# Altium schematic sheet Microprocessor Module (328).SchDoc
size A4; SheetNumber: 1; SheetTotal: 1
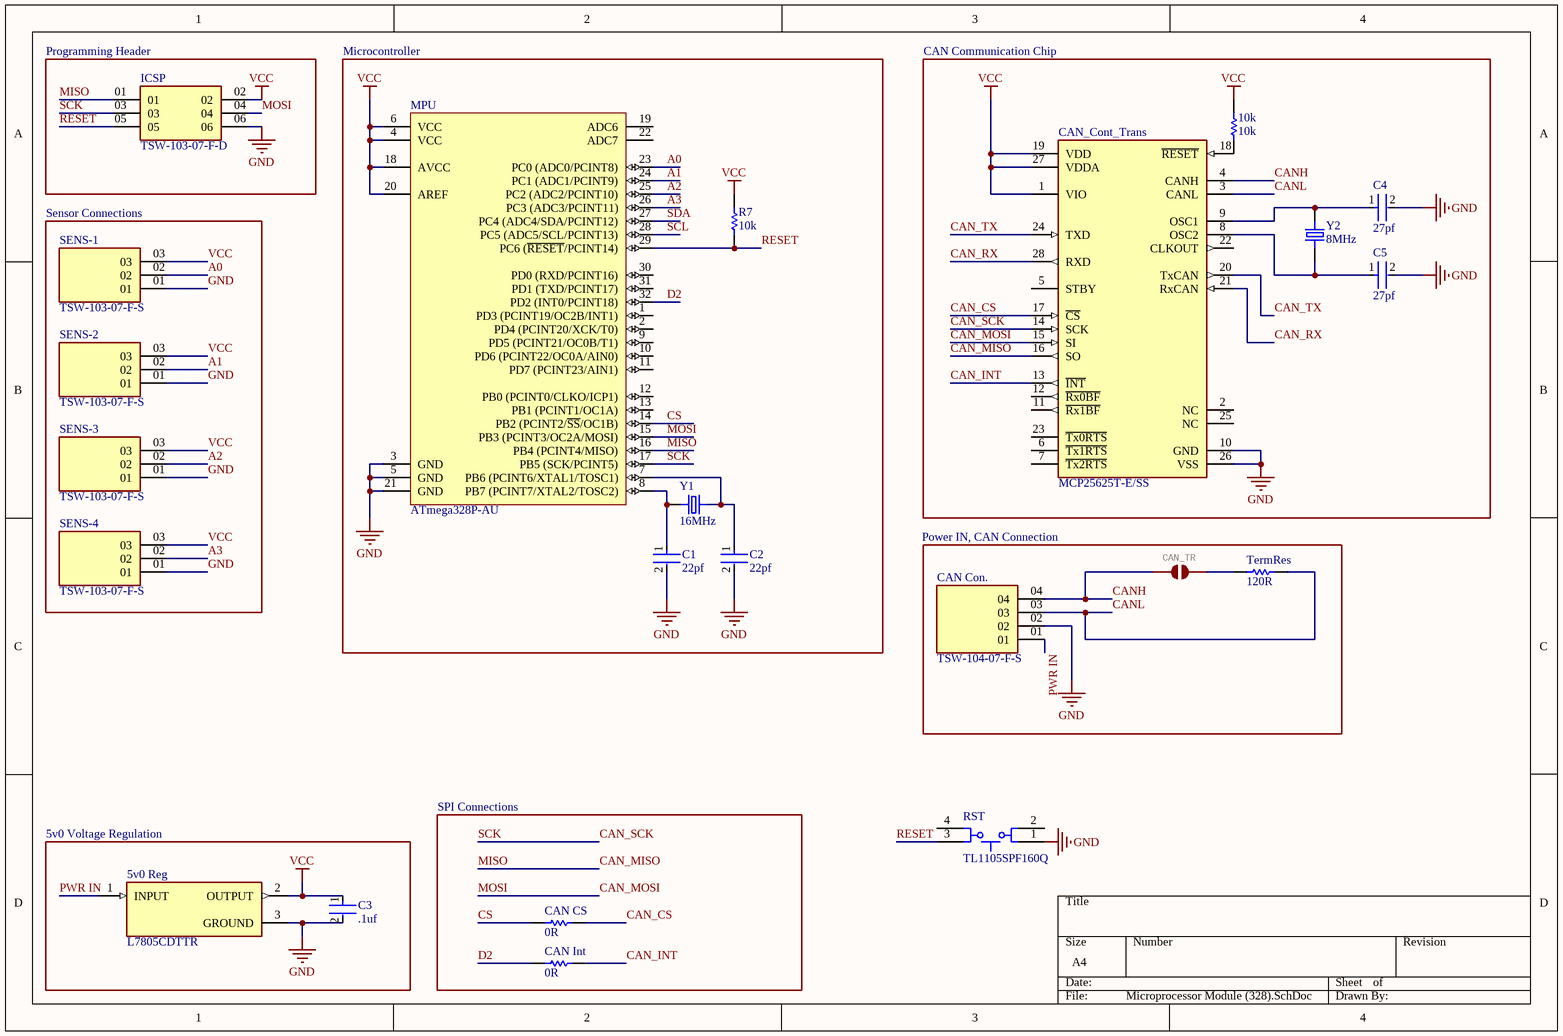
[diagram p0: Microprocessor Module (328).SchDoc]

## Parts
5v0_Reg  L7805CDTTR  [VREG_L7805CDTTR]
10k  10k  [RESC2013X60X40LL20T25]
C1  22pf  [FP-GRM21B-0_15-IPC_C]
C2  22pf  [FP-GRM21B-0_15-IPC_C]
C3  .1uf  [FP-GRM21B-0_15-IPC_C]
C4  27pf  [FP-GRM21B-0_15-IPC_C]
C5  27pf  [FP-GRM21B-0_15-IPC_C]
CAN_Con.  TSW-104-07-F-S  [SAMTEC_TSW-104-07-F-S]
CAN_Cont_Trans  MCP25625T-E/SS  [FP-C04-073-IPC_B]
CAN_CS  0R  [RESC2013X60X40LL20T25]
CAN_Int  0R  [RESC2013X60X40LL20T25]
CAN_TR  (no value)  [SMT-JUMPER_2_NO_SILK]
ICSP  TSW-103-07-F-D  [SAMTEC_TSW-103-07-F-D]
MPU  ATmega328P-AU  [32A_M]
R7  10k  [RESC2013X60X40LL20T25]
RST  TL1105SPF160Q  [ESWI-TL1105SPF_V]
SENS-1  TSW-103-07-F-S  [SAMTEC_TSW-103-07-F-S]
SENS-2  TSW-103-07-F-S  [SAMTEC_TSW-103-07-F-S]
SENS-3  TSW-103-07-F-S  [SAMTEC_TSW-103-07-F-S]
SENS-4  TSW-103-07-F-S  [SAMTEC_TSW-103-07-F-S]
TermRes  120R  [RESC2013X60X40LL20T25]
Y1  16MHz  [XTAL_ECS-080-20-5PX-TR]
Y2  8MHz  [XTAL_ECS-080-20-5PX-TR]

## Blocks framed on the sheet
Programming Header: ICSP
Microcontroller: C1 C2 MPU R7 Y1
CAN Communication Chip: 10k C4 C5 CAN_Cont_Trans Y2
Sensor Connections: SENS-1-SENS-4
Power IN, CAN Connection: CAN_Con. CAN_TR TermRes
5v0 Voltage Regulation: 5v0_Reg C3
SPI Connections: CAN_CS CAN_Int

## Nets
GND: 5v0_Reg.3(GROUND) C1.2 C2.2 C3.2 C4.2 C5.2 CAN_Con..02 CAN_Cont_Trans.10(GND) CAN_Cont_Trans.26(VSS) ICSP.06 MPU.3(GND) MPU.5(GND) MPU.21(GND) RST.1 SENS-1.01 SENS-2.01 SENS-3.01 SENS-4.01
VCC: 5v0_Reg.2(OUTPUT) 10k.2 C3.1 CAN_Cont_Trans.1(VIO) CAN_Cont_Trans.19(VDD) CAN_Cont_Trans.27(VDDA) ICSP.02 MPU.4(VCC) MPU.6(VCC) MPU.18(AVCC) MPU.20(AREF) R7.2 SENS-1.03 SENS-2.03 SENS-3.03 SENS-4.03
A0: MPU.23(PC0_(ADC0/PCINT8)) SENS-1.02
A1: MPU.24(PC1_(ADC1/PCINT9)) SENS-2.02
A2: MPU.25(PC2_(ADC2/PCINT10)) SENS-3.02
A3: MPU.26(PC3_(ADC3/PCINT11)) SENS-4.02
CAN_CS: CAN_Cont_Trans.17(~{CS}) CAN_CS.2
CAN_INT: CAN_Cont_Trans.13(~{INT}) CAN_Int.2
CAN_MISO: CAN_Cont_Trans.16(SO) ICSP.01 MPU.16(PB4_(PCINT4/MISO))  [also labelled MISO]
CAN_MOSI: CAN_Cont_Trans.15(SI) ICSP.04 MPU.15(PB3_(PCINT3/OC2A/MOSI))  [also labelled MOSI]
CAN_RX: CAN_Cont_Trans.21(RxCAN) CAN_Cont_Trans.28(RXD)
CAN_SCK: CAN_Cont_Trans.14(SCK) ICSP.03 MPU.17(PB5_(SCK/PCINT5))  [also labelled SCK]
CAN_TX: CAN_Cont_Trans.20(TxCAN) CAN_Cont_Trans.24(TXD)
CANH: CAN_Con..04 CAN_Cont_Trans.4(CANH) CAN_TR.1
CANL: CAN_Con..03 CAN_Cont_Trans.3(CANL) TermRes.1
CS: CAN_CS.1 MPU.14(PB2_(PCINT2/~{SS}/OC1B))
D2: CAN_Int.1 MPU.32(PD2_(INT0/PCINT18))
PWR IN: 5v0_Reg.1(INPUT) CAN_Con..01
RESET: ICSP.05 MPU.29(PC6_(~{RESET}/PCINT14)) R7.1 RST.3
SCL: MPU.28(PC5_(ADC5/SCL/PCINT13))
SDA: MPU.27(PC4_(ADC4/SDA/PCINT12))
Net10k_1: 10k.1 CAN_Cont_Trans.18(~{RESET})
NetC1_1: C1.1 MPU.8(PB7_(PCINT7/XTAL2/TOSC2)) Y1.2
NetC2_1: C2.1 MPU.7(PB6_(PCINT6/XTAL1/TOSC1)) Y1.1
NetC4_1: C4.1 CAN_Cont_Trans.9(OSC1) Y2.2
NetC5_1: C5.1 CAN_Cont_Trans.8(OSC2) Y2.1
NetCAN_TR_2: CAN_TR.2 TermRes.2

Not connected (* = marked no-connect by the designer): CAN_Cont_Trans 2(NC) 5(STBY) 6(~{Tx1RTS}) 7(~{Tx2RTS}) 11(~{Rx1BF}) 12(~{Rx0BF}) 22(CLKOUT) 23(~{Tx0RTS}) 25(NC); MPU 1(PD3_(PCINT19/OC2B/INT1)) 2(PD4_(PCINT20/XCK/T0)) 9(PD5_(PCINT21/OC0B/T1)) 10(PD6_(PCINT22/OC0A/AIN0)) 11(PD7_(PCINT23/AIN1)) 12(PB0_(PCINT0/CLKO/ICP1)) 13(PB1_(PCINT1/OC1A)) 19(ADC6) 22(ADC7) 30(PD0_(RXD/PCINT16)) 31(PD1_(TXD/PCINT17)); RST 2 4

## Library data of the parts
5v0_Reg = L7805CDTTR: LINEAR VOLT REG, 5V, 1.5A, TO-252-3; Fixed Output Voltage Nom.:5V; Adjustable Output Voltage Min:-; Adjustable Output Voltage Max:-; Input Voltage Min:10V; Input Voltage Max:35V; Product Range:5V 1.5A Linear Voltage Regulators; Output Current:1.5A; Output Type:Fixed; Linear Regulator Case Style:TO-252; No. of Pins:3Pins; Operating Temperature Min:0Â°C; Operating Temperature Max:125Â°C; Automotive Qualification Standard:-; MSL:MSL 1 - Unlimited; SVHC:No SVHC (15-Jan-2018); MF: STMicroelectronics; Availability: In Stock; Check_prices: https://www.snapeda.com/parts/L7805CDTTR/STMicroelectronics/view-part/?ref=eda; Package: None; Price: None; Purchase-URL: https://pricing.snapeda.com/search/part/L7805CDTTR/?ref=eda; SnapEDA_Link: https://www.snapeda.com/parts/L7805CDTTR/STMicroelectronics/view-part/?ref=snap; Value: *; MP: L7805CDTTR
10k CAN_CS CAN_Int R7 TermRes = CMP-2001-00645-1: Part Number: ERA6AEB473V; Manufacturer: Panasonic
C1-C5 = CMP-2007-03541-2: Chip Multilayer Ceramic Capacitors for General Purpose, 0805, 10uF, X5R, 15%, 10%, 25V; Length: 2mm; Depth: 1.25mm; Termination: SMD/SMT; Voltage: 25V; Height: 1.25mm; Material: Ceramic; Thickness: 0.053inch; Radiation Hardening: No; Min Operating Temperature: -55°C; Width: 0.049inch; Package Quantity: 1; Mount: Surface Mount; Dielectric: X5R; Packaging: Tape and Reel; Capacitance: 10uF; Voltage Rating (DC): 25V; Lead Free: Lead Free; Max Operating Temperature: 85°C; Case Code (Imperial): 0805; Case/Package: 0805; Tolerance: 10%; Voltage Rating: 25V; Case Code (Metric): 2012
CAN_Con. = TSW-104-07-F-S: MF: Samtec; MP: TSW-104-07-F-S; Price: None; Package: None; Availability: Unavailable; Value: *
CAN_Cont_Trans = CMP-06279-000016-1: IC TRANSCEIVER 1/1 28SSOP; Max Supply Voltage: 5.5V; Number of Receivers: 1; Receiver Hysteresis: 200mV; Data Rate: 1Mbps; Min Supply Voltage: 4.5V; Propagation Delay: 125ns; Operating Supply Current: 70mA; Interface: SPI; Case/Package: SSOP; Max Operating Temperature: 125°C; Weight: 0.080001oz; Mount: Surface Mount; RoHS Compliant: Yes; Package Quantity: 2100; Packaging: Tape and Reel; Min Operating Temperature: -40°C; Number of Pins: 28; Number of Drivers: 1; Number of Transceivers: 1
CAN_TR = JUMPER-SMT_2_NO_SILK: GateName_1: G$1; SymbolName_1: SMT-JUMPER_2_NO; DeviceName: _SILK; LibraryName: SparkFun-Jumpers; DeviceSetName: JUMPER-SMT_2_NO; Package: SMT-JUMPER_2_NO_SILK
ICSP = TSW-103-07-F-D: MF: Samtec; Package: None; Availability: Unavailable; Value: *; MP: TSW-103-07-F-D; Price: None
MPU = CMP-0095-00269-2: 8-bit AVR Microcontroller, 32KB Flash, 1KB EEPROM, 2KB SRAM, 32-pin TQFP, Industrial Grade (-40°C to 85°C); PackageDescription: 32-Lead, 7x7x1.0 mm Body, 0.8mm Lead Pitch, Thin Profile Plastic Quad Flat Package (TQFP); DatasheetVersion: revD, May-2011; RevisionNote: DatasheetVersion & PackageVersion updated. URLs added.; ComponentLink1URL: http://www.atmel.com/; ComponentLink2Description: ATmega48A/48PA/88A/88PA/168A/168PA/328/328P Datasheet; Code_JEDEC: MS-026-ABA; ComponentLink1Description: Manufacturer URL; PackageReference: 32A; ComponentLink3Description: ATmega48A/48PA/88A/88PA/168A/168PA/328/328P Summary; ComponentLink2URL: http://www.atmel.com/dyn/resources/prod_documents/doc8271.pdf; PackageVersion: revC, Oct-2010; ComponentLink3URL: http://www.atmel.com/dyn/resources/prod_documents/8271S.pdf
RST = CMP-2000-07248-1: Tact Switch, SPST-NO, 50 mA, 12 VDC, -20 to 70 degC, 4-Pin THD, RoHS, Bulk; Manufacturer: E-Switch; Actuation Force: 1.6N; Actuator Style: RoundButton; Package URL: http://spec_sheets.e-switch.com/specs/P010201.pdf; Contact Material: Silver; Size: 6x6mm; Manufacturer URL: http://www.e-switch.ch/en/; Datasheet Version: 12/2013; Package Description: 4-Pin Through Hole Device, Body 6 x 6 mm; Datasheet URL: https://www.e-switch.com/system/asset/product_line/data_sheet/140/TL1105.pdf; Termination Style: RightAngle; Package Reference: TL1105SPF; Mounting Technology: ThroughHole
SENS-1-SENS-4 = TSW-103-07-F-S: MF: Samtec; Package: None; Price: None; MP: TSW-103-07-F-S; Availability: Unavailable; Value: *
Y1 Y2 = ECS-080-20-5PX-TR: 8 MHz Â±30ppm Crystal 20pF 60 Ohms HC-49/US; MF: ECS; Price: None; Availability: In Stock; MP: ECS-080-20-5PX-TR; Package: HC49/US ECS International; SnapEDA_Link: https://www.snapeda.com/parts/ECS-080-20-5PX-TR/ECS+Inc./view-part/?ref=snap; Check_prices: https://www.snapeda.com/parts/ECS-080-20-5PX-TR/ECS+Inc./view-part/?ref=eda; Value: *; Purchase-URL: https://pricing.snapeda.com/search/part/ECS-080-20-5PX-TR/?ref=eda